# EasyEDA schematic RPi sheet.json
TITLE: Sheet_1; REV: 1.0; Date: 2020-05-24; Sheet: 1/1; Drawn By: Vilanya; Company: Your Company
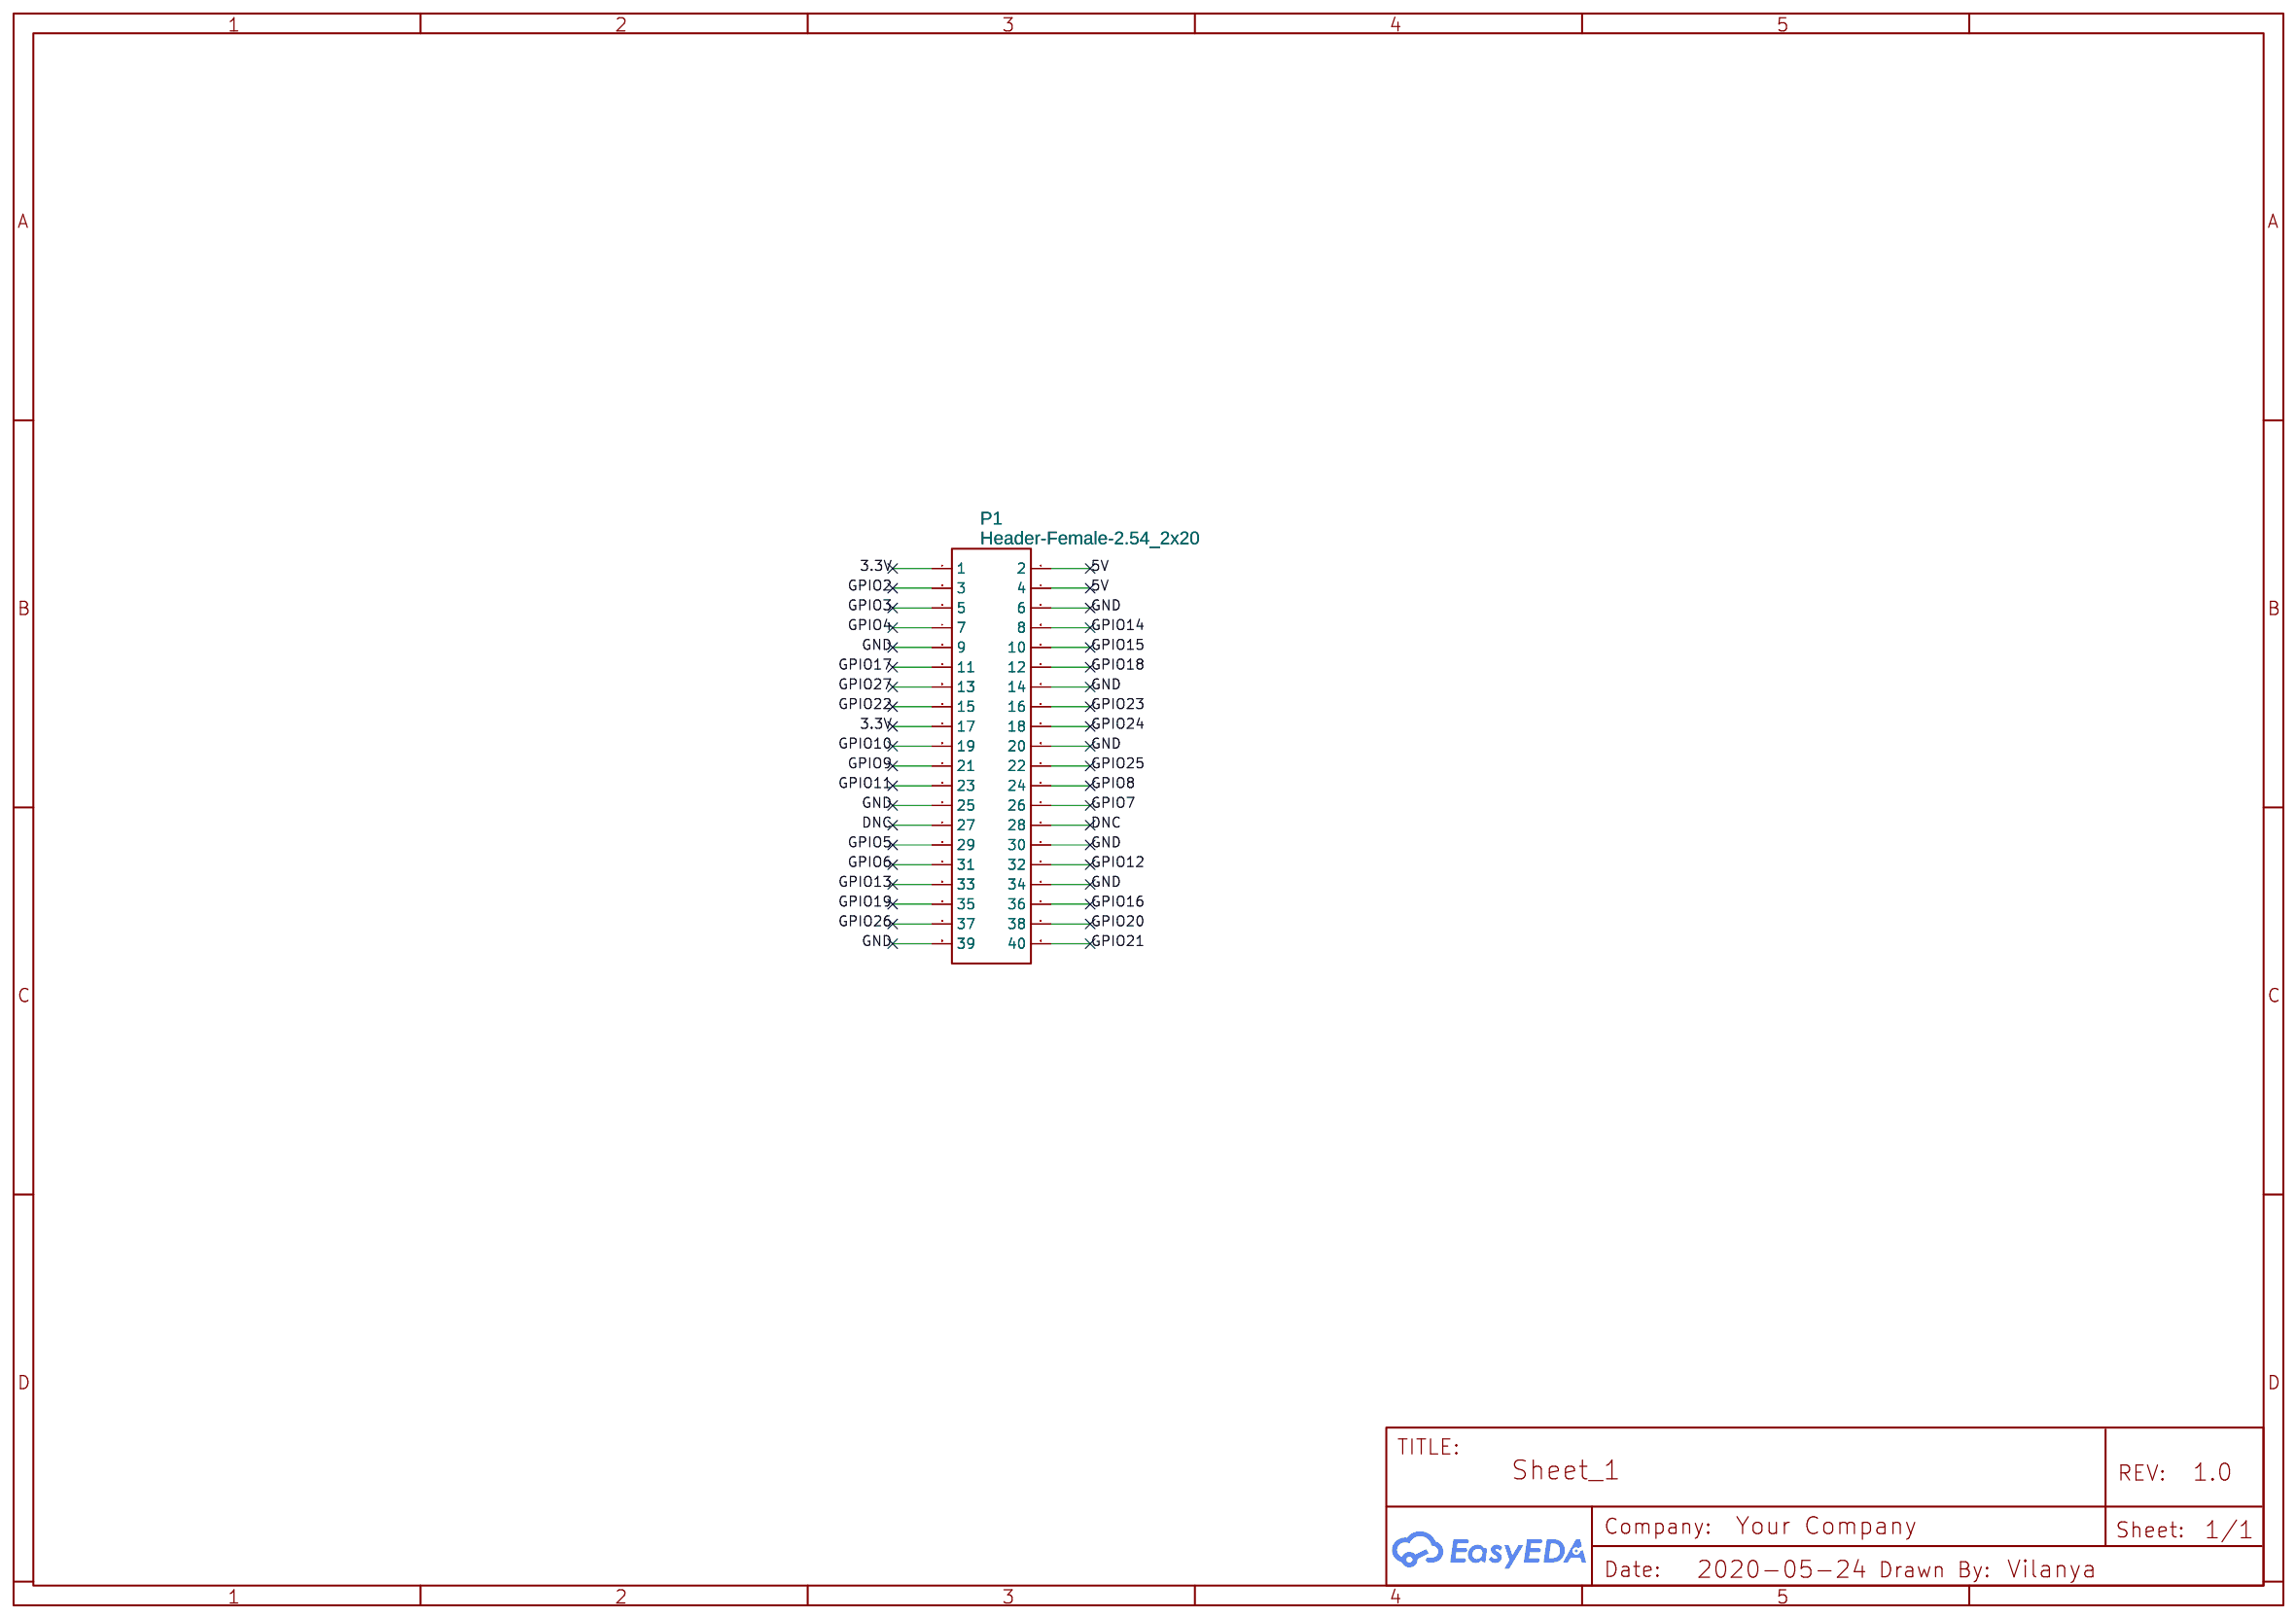
[diagram p0: schematic sheet]

## Parts
P1  Header-Female-2.54_2x20  [HDR-TH_40P-P2.54-V-R2-C20-S2.54]

## Library data of the parts
P1 = Header-Female-2.54_2x20: Supplier: LCSC; Manufacturer: BOOMELE; Manufacturer Part: 2.54mm 2*20PFemale header; image: //image.lceda.cn/szlcsc/C50982.jpg; Supplier Part: C50982

## Nets
3.3V: P1.1 P1.17
5V: P1.2 P1.4
GND: P1.6 P1.9 P1.14 P1.20 P1.25 P1.30 P1.34 P1.39
DNC: P1.27 P1.28
GPIO2: P1.3
GPIO3: P1.5
GPIO4: P1.7
GPIO5: P1.29
GPIO6: P1.31
GPIO7: P1.26
GPIO8: P1.24
GPIO9: P1.21
GPIO10: P1.19
GPIO11: P1.23
GPIO12: P1.32
GPIO13: P1.33
GPIO14: P1.8
GPIO15: P1.10
GPIO16: P1.36
GPIO17: P1.11
GPIO18: P1.12
GPIO19: P1.35
GPIO20: P1.38
GPIO21: P1.40
GPIO22: P1.15
GPIO23: P1.16
GPIO24: P1.18
GPIO25: P1.22
GPIO26: P1.37
GPIO27: P1.13
